# Altium schematic sheet C0 DEVB V1R0.SchDoc
size A4; SheetNumber: 1; SheetTotal: 1
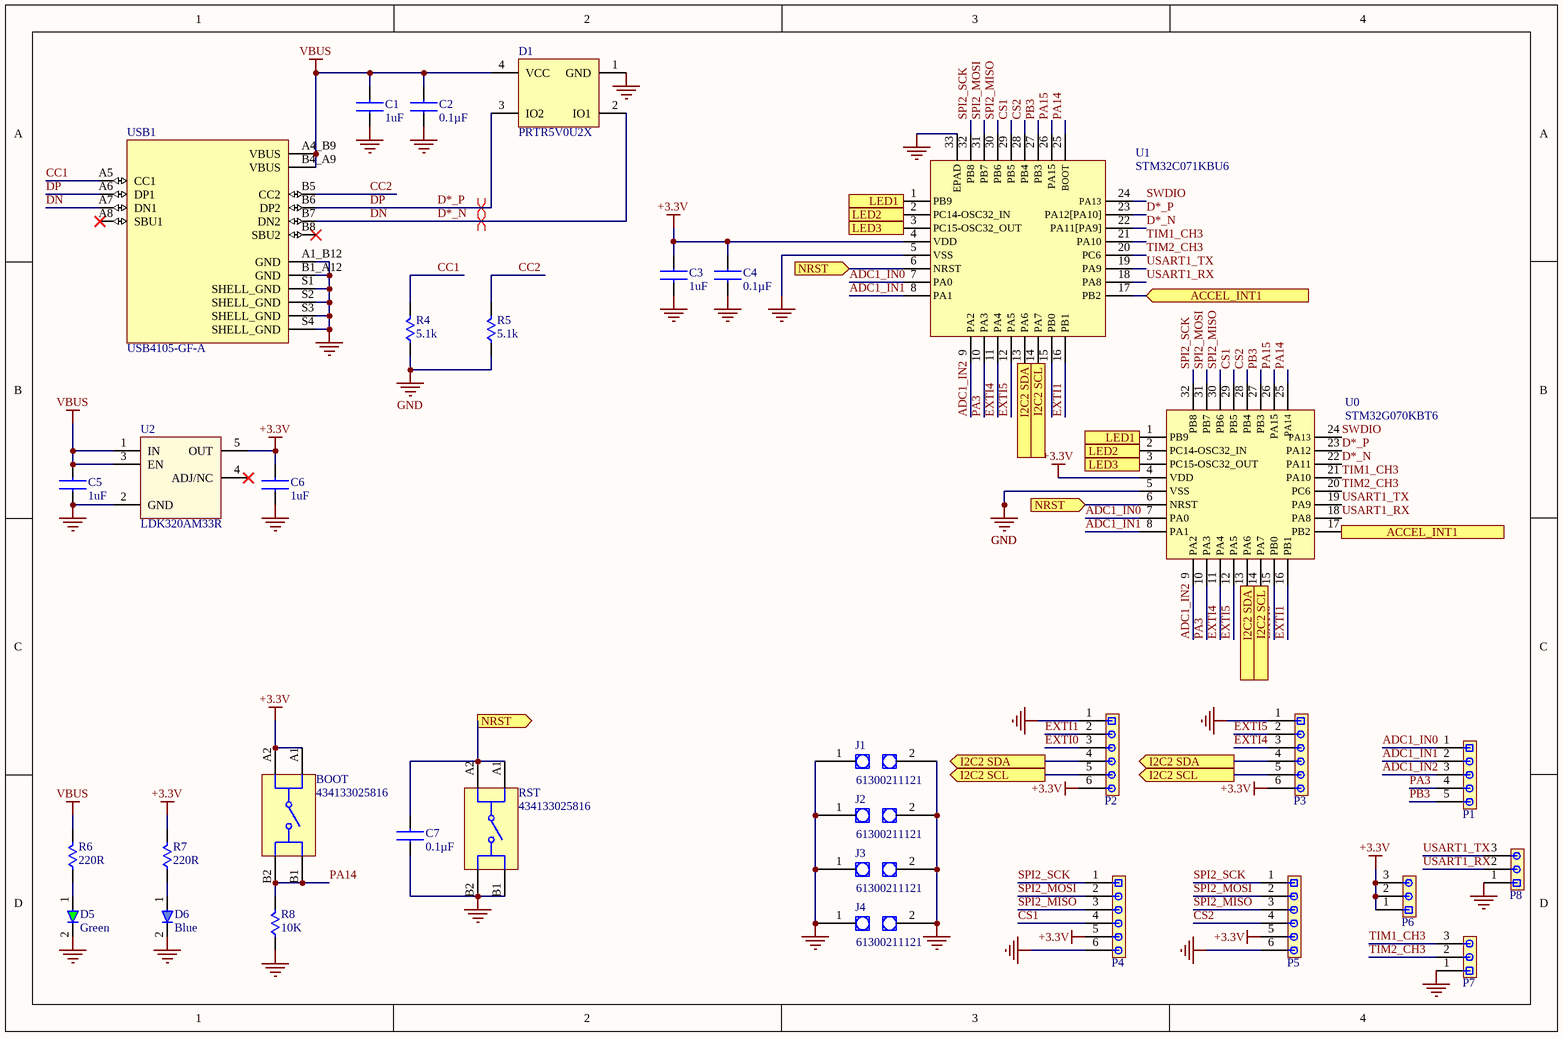
[diagram p0: C0 DEVB V1R0.SchDoc]

## Parts
BOOT  434133025816  [434133025816]
C1  1uF  [0603-CAP]
C2  0.1µF  [0603-CAP]
C3  1uF  [0603-CAP]
C4  0.1µF  [0603-CAP]
C5  1uF  [0603-CAP]
C6  1uF  [0603-CAP]
C7  0.1µF  [0603-CAP]
D1  PRTR5V0U2X  [SOT143B]
D5  Green  [0603-LED-GREEN]
D6  Blue  [0603-LED-BLUE]
J1  61300211121  [61300211121]
J2  61300211121  [61300211121]
J3  61300211121  [61300211121]
J4  61300211121  [61300211121]
P1  PPPC051LFBN-RC  [PPPC051LFBN-RC]  (value not drawn)
P2  68000-406HLF  [68016-406HLF]  (value not drawn)
P3  68000-406HLF  [68016-406HLF]  (value not drawn)
P4  68000-406HLF  [68016-406HLF]  (value not drawn)
P5  68000-406HLF  [68016-406HLF]  (value not drawn)
P6  61300311121  [61300311121]  (value not drawn)
P7  61300311121  [61300311121]  (value not drawn)
P8  61300311121  [61300311121]  (value not drawn)
R4  5.1k  [0603-RES]
R5  5.1k  [0603-RES]
R6  220R  [0603-RES]
R7  220R  [0603-RES]
R8  10K  [0603-RES]
RST  434133025816  [434133025816]
U0  STM32G070KBT6  [LQFP-32]
U1  STM32C071KBU6  [QFN32(5x5)]
U2  LDK320AM33R  [SOT-23-5]
USB1  USB4105-GF-A  [USB4105-GF-A]

## Ports
ACCEL_INT1 (in, see C0 DEVB V1R0[3B], PERIPHERAL[3B]), ACCEL_INT1 (in, see C0 DEVB V1R0[4C], PERIPHERAL[3B]), I2C2 SCL (out, see C0 DEVB V1R0[3B], C0 DEVB V1R0[3D], C0 DEVB V1R0[4C], PERIPHERAL[1A], PERIPHERAL[3A], PERIPHERAL[3B]), I2C2 SCL (out, see C0 DEVB V1R0[3B], C0 DEVB V1R0[3D], PERIPHERAL[1A], PERIPHERAL[3A], PERIPHERAL[3B]), I2C2 SCL (out, see C0 DEVB V1R0[3D], C0 DEVB V1R0[4C], PERIPHERAL[1A], PERIPHERAL[3A], PERIPHERAL[3B]), I2C2 SDA (out, see C0 DEVB V1R0[3B], C0 DEVB V1R0[3C], C0 DEVB V1R0[4C], PERIPHERAL[1A], PERIPHERAL[3A], PERIPHERAL[3B]), I2C2 SDA (out, see C0 DEVB V1R0[3B], C0 DEVB V1R0[3C], PERIPHERAL[1A], PERIPHERAL[3A], PERIPHERAL[3B]), I2C2 SDA (out, see C0 DEVB V1R0[3C], C0 DEVB V1R0[4C], PERIPHERAL[1A], PERIPHERAL[3A], PERIPHERAL[3B]), LED1 (out, see C0 DEVB V1R0[3A], PERIPHERAL[1D]), LED1 (out, see C0 DEVB V1R0[3B], PERIPHERAL[1D]), LED2 (out, see C0 DEVB V1R0[3A], PERIPHERAL[1D]), LED2 (out, see C0 DEVB V1R0[3B], PERIPHERAL[1D]), LED3 (out, see C0 DEVB V1R0[3A], PERIPHERAL[1D]), LED3 (out, see C0 DEVB V1R0[3B], PERIPHERAL[1D]), NRST (in, see C0 DEVB V1R0[2C], C0 DEVB V1R0[3B]), NRST (out, see C0 DEVB V1R0[3B])

## Nets
+3.3V: BOOT.A1 BOOT.A2 C3.1 C4.1 C6.1 P2.6 P3.6 P4.5 P5.5 P6.1 P6.2 P6.3 R7.2 U0.4(VDD) U1.4(VDD) U2.5(OUT)
GND: C1.2 C2.2 C3.2 C4.2 C5.2 C6.2 C7.2 D1.1(GND) D5.2(+) D6.2(-) J1.1 J1.2 J2.1 J2.2 J3.1 J3.2 J4.1 J4.2 P2.1 P3.1 P4.6 P5.6 P7.1 P8.1 R4.1 R5.1 R8.1 RST.B1 RST.B2 U0.5(VSS) U1.5(VSS) U1.33(EPAD) U2.2(GND) USB1.A1_B12(GND) USB1.B1_A12(GND) USB1.S1(SHELL_GND) USB1.S2(SHELL_GND) USB1.S3(SHELL_GND) USB1.S4(SHELL_GND)
VBUS: C1.1 C2.1 C5.1 D1.4(VCC) R6.2 U2.1(IN) U2.3(EN) USB1.A4_B9(VBUS) USB1.B4_A9(VBUS)
ACCEL_INT1: U0.17(PB2) U1.17(PB2) ; port ACCEL_INT1
ADC1_IN0: P1.1 U0.7(PA0) U1.7(PA0)
ADC1_IN1: P1.2 U0.8(PA1) U1.8(PA1)
ADC1_IN2: P1.3 U0.9(PA2) U1.9(PA2)
CC1: R4.2 USB1.A5(CC1)
CC2: R5.2 USB1.B5(CC2)
CS1: P4.4 U0.29(PB5) U1.29(PB5)
CS2: P5.4 U0.28(PB4) U1.28(PB4)
D*_N: D1.2(IO1) U0.22(PA11) U1.22(PA11[PA9]) USB1.A7(DN1) USB1.B7(DN2)  [also labelled DN]
D*_P: D1.3(IO2) U0.23(PA12) U1.23(PA12[PA10]) USB1.A6(DP1) USB1.B6(DP2)  [also labelled DP]
EXTI0: P2.3 U0.15(PB0)
EXTI1: P2.2 U0.16(PB1) U1.16(PB1)
EXTI4: P3.3 U0.11(PA4) U1.11(PA4)
EXTI5: P3.2 U0.12(PA5) U1.12(PA5)
I2C2 SCL: P2.5 P3.5 U0.14(PA7) U1.14(PA7) ; port I2C2 SCL
I2C2 SDA: P2.4 P3.4 U0.13(PA6) U1.13(PA6) ; port I2C2 SDA
LED1: U0.1(PB9) U1.1(PB9) ; port LED1
LED2: U0.2(PC14-OSC32_IN) U1.2(PC14-OSC32_IN) ; port LED2
LED3: U0.3(PC15-OSC32_OUT) U1.3(PC15-OSC32_OUT) ; port LED3
NRST: C7.1 RST.A1 RST.A2 U0.6(NRST) U1.6(NRST) ; port NRST
PA3: P1.4 U0.10(PA3) U1.10(PA3)
PA14: BOOT.B1 BOOT.B2 R8.2 U0.25(PA14) U1.25(BOOT)
PA15: U0.26(PA15) U1.26(PA15)
PB3: P1.5 U0.27(PB3) U1.27(PB3)
SPI2_MISO: P4.3 P5.3 U0.30(PB6) U1.30(PB6)
SPI2_MOSI: P4.2 P5.2 U0.31(PB7) U1.31(PB7)
SPI2_SCK: P4.1 P5.1 U0.32(PB8) U1.32(PB8)
SWDIO: U0.24(PA13) U1.24(PA13)
TIM1_CH3: P7.3 U0.21(PA10) U1.21(PA10)
TIM2_CH3: P7.2 U0.20(PC6) U1.20(PC6)
USART1_RX: P8.2 U0.18(PA8) U1.18(PA8)
USART1_TX: P8.3 U0.19(PA9) U1.19(PA9)
NetD5_1: D5.1(-) R6.1
NetD6_1: D6.1(+) R7.1

Not connected (* = marked no-connect by the designer): U1 15(PB0); U2 4(ADJ/NC)*; USB1 A8(SBU1)* B8(SBU2)*

## Layout directives
differential pair: D*_N, D*_P

## Library data of the parts
BOOT RST = CMP-03913-99472342-2: Tactile Switch, 0.05A, 16Vdc, 160Gf, Smd Rohs Compliant: Yes; Current Rating: 50mA; Voltage Rating: 16V; Insulation Resistance: 100MΩ; Contact Plating: Silver; Max Operating Temperature: 85°C; Min Operating Temperature: -40°C; RoHS: Compliant; Height: 2.5mm; Packaging: Tape and Reel
C1 C3 C5 C6 = CL10B105KA8NNNC: CAP CER 1UF 25V X7R 0603; Manufacturer: Samsung; Tolerance: 10%; Supplier 1: Digi-Key; Manufacturer Part Number: CL10B105KA8NNNC; RoHS: Yes; Category: Ceramic Capacitors; Pricing 1: 1=0,10000, 10=0,04500, 50=0,02460, 100=0,02010, 500=0,01436, 1000=0,01128 (USD); Mount: Surface Mount; Case/Package: 0603; Case Code (Metric): 1608; Case Code (Imperial): 0603; Contact Plating: Tin; Min Operating Temperature: -55°C; Max Operating Temperature: 125°C; Capacitance: 1uF; Packaging: Tape and Reel; Voltage Rating: 25V; Package Quantity: 1; Dielectric: X7R; Voltage: 25V; Series: CL; Construction: Flat; Length: 1.6mm; Width: 0.031inch; Height: 0.8mm; Thickness: 0.035inch; Depth: 0.8mm; Radiation Hardening: No; RoHS Compliant: Yes; ComponentLink1URL: https://datasheet.ciiva.com/16449/cl10b105ka8nnnc-16449544.pdf?src-supplier=Future+Electronics; ComponentLink1Description: https://datasheet.ciiva.com/16449/cl10b105ka8nnnc-16449544.pdf?src-supplier=Future+Electronics; ComponentLink2URL: https://datasheet.ciiva.com/15195/getdatasheetpartid-359554-15195726.pdf?src-supplier=Verical; ComponentLink2Description: https://datasheet.ciiva.com/15195/getdatasheetpartid-359554-15195726.pdf?src-supplier=Verical; Supplier Part Number 1: 1276-1184-1-ND
C2 = 06033C104JAZ2A: CAP CER 0.1UF 25V X7R 0603; Manufacturer: AVX Corporation; Tolerance: ±5%; Supplier 1: Digi-Key; Manufacturer Part Number: 06033C104JAZ2A; RoHS: RoHS Compliant; Category: Capacitors; Stock 1: 19625; Pricing 1: 1=0.13, 10=0.094, 100=0.044, 500=0.03086, 1000=0.02555 (USD); Packaging: Cut Tape (CT); Part Status: Active; Temperature Coefficient: X7R; Operating Temperature: -55°C ~ 125°C; Features: Soft Termination; Ratings: -; Applications: Boardflex Sensitive; Failure Rate: -; Mounting Type: Surface Mount, MLCC; Package / Case: 0603 (1608 Metric); Size / Dimension: 0.063" L x 0.032" W (1.60mm x 0.80mm); Height - Seated (Max): -; Thickness (Max): 0.035" (0.90mm); Lead Spacing: -; Lead Style: -; ComponentLink1URL: http://datasheets.avx.com/FlexitermMLCC.pdf; ComponentLink1Description: http://datasheets.avx.com/FlexitermMLCC.pdf; Supplier Part Number 1: 478-10279-1-ND; Voltage - Rated: 25V
C4 C7 = CL10B104KB8NNNL: CAP CER 0.1UF 50V X7R 0603; Manufacturer: Samsung; Capacitance: 100nF; Tolerance: 10%; Supplier 1: Digi-Key; Manufacturer Part Number: CL10B104KB8NNNL; Stock 1: 1583462; Pricing 1: 1 = 0,10000, 10 = 0,03000, 100 = 0,01350, 500 = 0,00966, 1000 = 0,00759, 2500 = 0,00690, 5000 = 0,00635 (USD); RoHS: Yes; Mount: Surface Mount; Case/Package: 0603; Min Operating Temperature: -55°C; Max Operating Temperature: 125°C; Packaging: Tape and Reel; Package Quantity: 15000; Voltage Rating: 50V; Dielectric: X7R; Voltage Rating (DC): 50V; Length: 1.6mm; Height: 0.8mm; Width: 0.031inch; Thickness: 0.035inch; Depth: 0.8mm; Radiation Hardening: No; ComponentLink1URL: https://datasheet.ciiva.com/25741/cl10b104kb8nnnl-25741341.pdf?src-supplier=Digi-Key; ComponentLink1Description: https://datasheet.ciiva.com/25741/cl10b104kb8nnnl-25741341.pdf?src-supplier=Digi-Key; ComponentLink2URL: https://datasheet.ciiva.com/26838/getdatasheetpartid-357523-26838415.pdf?src-supplier=Verical; ComponentLink2Description: https://datasheet.ciiva.com/26838/getdatasheetpartid-357523-26838415.pdf?src-supplier=Verical; Supplier Part Number 1: 1276-CL10B104KB8NNNLCT-ND
D1 = PRTR5V0U2X: TVS DIODE 5.5VWM SOT143B; Manufacturer 1: Nexperia; Manufacturer Part  1: PRTR5V0U2X,215; Direction: 211Direction; Breakdown Voltage: 6V; Value: 1pF; Number of Channels: 2NUMBER; Operating Supply Voltage: 700mV; Reverse Standoff Voltage: 5.5V; Supplier 1: Digikey; RoHS: Yes; Category: ESD and Circuit Protection ICs; Stock 1: 43284; Pricing 1: 1=0,4, 10=0,346, 100=0,2402, 500=0,18754, 1000=0,15243 (USD); Pins: 4NUMBER; Height: 1.1mm; RoHS Compliant: Yes; ComponentLink1URL: http://www.farnell.com/datasheets/109718.pdf?src-supplier=Farnell; ComponentLink1Description: http://www.farnell.com/datasheets/109718.pdf?src-supplier=Farnell; ComponentLink2URL: https://assets.nexperia.com/documents/data-sheet/PRTR5V0U2X.pdf?src-supplier=Digikey; ComponentLink2Description: https://assets.nexperia.com/documents/data-sheet/PRTR5V0U2X.pdf?src-supplier=Digikey; ComponentLink3URL: https://datasheet.octopart.com/PRTR5V0U2X%2C215-Nexperia-datasheet-5405949.pdf?src-supplier=Element14; ComponentLink3Description: https://datasheet.octopart.com/PRTR5V0U2X%2C215-Nexperia-datasheet-5405949.pdf?src-supplier=Element14; ComponentLink4URL: http://www.farnell.com/datasheets/109718.pdf?src-supplier=Newark; ComponentLink4Description: http://www.farnell.com/datasheets/109718.pdf?src-supplier=Newark; Supplier Part Number 1: 1727-3884-1-ND
D5 = 150060VS75000: LED GREEN CLEAR 0603 SMD; Manufacturer 1: Wurth Electronics; Luminous Intensity: 40mcd; Viewing Angle: 140°; Forward Voltage: 2V; Wavelength: 570nm; Lens Style: Clear,Rectangular; Forward Current: 30mA; Test Current: 20mA; Supplier 1: Digi-Key; Manufacturer Part Number 1: 150060VS75000; Stock 1: 114121; Pricing 1: 1=0,14000, 50=0,13300, 100=0,11550 (USD); RoHS: Yes; Mount: Surface Mount; Case/Package: 0603; Number of Pins: 2; Color: Green; Case Code (Metric): 1608; Case Code (Imperial): 0603; Min Operating Temperature: -40°C; Max Operating Temperature: 85°C; Package Quantity: 1; Packaging: Tape and Reel; Dominant Wavelength: 570nm; Length: 1.6mm; Width: 0.8mm; Height: 0.7mm; REACH SVHC: Unknown; RoHS Compliant: Yes; ComponentLink1URL: https://datasheet.ciiva.com/29562/150060vs75000-29562919.pdf?src-supplier=Digi-Key; ComponentLink1Description: https://datasheet.ciiva.com/29562/150060vs75000-29562919.pdf?src-supplier=Digi-Key; Supplier Part Number 1: 732-4980-1-ND
D6 = 150060BS75000: LED BLUE CLEAR 0603 SMD; Manufacturer: Wurth Electronics; Luminous Intensity: 145mcd; Forward Current: 30mA; Forward Voltage: 3.2V; Wavelength: 470nm; Viewing Angle: 140°; Lens Style: Clear,Rectangular; Test Current: 20mA; Supplier 1: Digi-Key; Manufacturer Part Number: 150060BS75000; Stock 1: 27240; Pricing 1: 1 = 0,16000, 50 = 0,14500, 100 = 0,12500, 500 = 0,10800 (USD); RoHS: Yes; Mount: Surface Mount; Case/Package: 0603; Color: Blue; Case Code (Metric): 1608; Case Code (Imperial): 0603; Min Operating Temperature: -40°C; Max Operating Temperature: 85°C; Package Quantity: 4000; Packaging: Cut Tape; Dominant Wavelength: 470nm; Length: 1.6mm; Height: 0.7mm; Width: 0.8mm; REACH SVHC: Unknown; ComponentLink1URL: https://datasheet.ciiva.com/29563/150060bs75000-29563034.pdf?src-supplier=Digi-Key; ComponentLink1Description: https://datasheet.ciiva.com/29563/150060bs75000-29563034.pdf?src-supplier=Digi-Key; ComponentLink2URL: https://datasheet.ciiva.com/29279/759426-da-01-en-chipled-0603-w-kl-blau-150060bs75000-29279193.pdf?src-supplier=Conrad; ComponentLink2Description: https://datasheet.ciiva.com/29279/759426-da-01-en-chipled-0603-w-kl-blau-150060bs75000-29279193.pdf?src-supplier=Conrad; ComponentLink3URL: https://datasheet.ciiva.com/48430/150060bs75000-eng-tds-48430039.pdf?src-supplier=Distrelec; ComponentLink3Description: https://datasheet.ciiva.com/48430/150060bs75000-eng-tds-48430039.pdf?src-supplier=Distrelec; ComponentLink4URL: https://datasheet.ciiva.com/22656/1911343-22656939.pdf?src-supplier=Element14; ComponentLink4Description: https://datasheet.ciiva.com/22656/1911343-22656939.pdf?src-supplier=Element14; ComponentLink5URL: https://datasheet.ciiva.com/29563/150060bs75000-29563035.pdf?src-supplier=Digi-Key; ComponentLink5Description: https://datasheet.ciiva.com/29563/150060bs75000-29563035.pdf?src-supplier=Digi-Key; ComponentLink6URL: https://datasheet.ciiva.com/29563/150060bs75000-29563036.pdf?src-supplier=Digi-Key; ComponentLink6Description: https://datasheet.ciiva.com/29563/150060bs75000-29563036.pdf?src-supplier=Digi-Key; Supplier Part Number 1: 732-4966-1-ND
J1-J4 = 61300211121: CONN HEADER VERT 2POS 2.54MM; Manufacturer: Wurth Electronics; Current Rating: 3A; Voltage Rating: 250V; Number of Positions: 2; Gender: Male; Connector Type: Male Pin; Pitch: 0.1inch; Supplier 1: Digi-Key; Manufacturer Part Number: 61300211121; Stock 1: 102087; Pricing 1: 1 = 0,13000, 10 = 0,10600, 25 = 0,08800, 50 = 0,07400, 100 = 0,06700, 1000 = 0,06100 (USD); RoHS: Yes; Mount: Through Hole; Contact Plating: Gold; Housing Material: PBT; Contact Material: Copper Alloy,Copper; Color: Black; Min Operating Temperature: -40°C; Max Operating Temperature: 125°C; Number of Rows: 1; Contact Gender: Male; Packaging: Bulk; Termination: Through Hole; Number of Contacts: 2; Contact Mating Length: 0.236inch; REACH SVHC: Unknown; Lead Free: Lead Free; ComponentLink1URL: https://datasheet.ciiva.com/13619/6130xx11121-48870-13619345.pdf?src-supplier=Mouser; ComponentLink1Description: https://datasheet.ciiva.com/13619/6130xx11121-48870-13619345.pdf?src-supplier=Mouser; Supplier Part Number 1: 732-5315-ND
P1 = PPPC051LFBN-RC: CONN HDR 5POS 0.1 GOLD PCB; Manufacturer 1: Sullins; Number of Positions: 5; Connector Type: Header; Pitch: 0.1inch; Supplier 1: Digi-Key; Manufacturer Part Number 1: PPPC051LFBN-RC; RoHS: Yes; Category: Connectors; Stock 1: 13836; Pricing 1: 1=0,49000, 10=0,45900, 100=0,35190, 500=0,30600, 1000=0,25245, 5000=0,22185, 10000=0,22100 (USD); Mount: Through Hole; Color: Black; Contact Plating: Gold; Contact Material: Bronze; Housing Material: Plastic; Package Quantity: 1000; Number of Rows: 1; Packaging: Bulk; Termination: Solder; Contact Type: Female Socket; Length: 13.2mm; Width: 2.5mm; Height: 8.5mm; Lead Free: Lead Free; RoHS Compliant: Yes; ComponentLink1URL: https://media.digikey.com/pdf/Data%20Sheets/Sullins%20PDFs/Female_Headers.100_DS.pdf?src-supplier=Digi-Key; ComponentLink1Description: https://media.digikey.com/pdf/Data%20Sheets/Sullins%20PDFs/Female_Headers.100_DS.pdf?src-supplier=Digi-Key; ComponentLink2URL: http://www.sullinscorp.com/catalogs/78_Page80-81_HEADER_.100_2.54mm_FEMALE.pdf?src-supplier=Future+Electronics; ComponentLink2Description: http://www.sullinscorp.com/catalogs/78_Page80-81_HEADER_.100_2.54mm_FEMALE.pdf?src-supplier=Future+Electronics; Supplier Part Number 1: S7038-ND
P2-P5 = 68016-406HLF: CONN HEADER R/A 6POS 2.54MM; Manufacturer 1: Amphenol FCI; Connector Type: Male Pin; Gender: Male; Current Rating: 3A; Voltage Rating: 1.5kV; Number of Positions: 6; Insulation Resistance: 5GR; Contact Post Length: 3.05mm; Supplier 1: Digi-Key; Manufacturer Part Number 1: 68016-406HLF; RoHS: Yes; Category: Headers and Wire Housings; Stock 1: 2017; Pricing 1: 1=0,36000, 10=0,34400, 100=0,24080, 500=0,20644, 1000=0,17203, 5000=0,14745, 10000=0,13762 (USD); Mount: Through Hole; Housing Material: Thermoplastic; Contact Plating: Tin; Contact Material: Bronze; Color: Black; Min Operating Temperature: -65°C; Max Operating Temperature: 125°C; Packaging: Bulk; Number of Rows: 1; Contact Gender: Male; Package Quantity: 100; Termination: Solder; Number of Contacts: 6; Pitch: 2.54mm; Contact Mating Length: 0.23inch; Radiation Hardening: No; Flammability Rating: UL94 V-0; ComponentLink1URL: https://datasheet.ciiva.com/728/68015-728878.pdf?src-supplier=Digi-Key; ComponentLink1Description: https://datasheet.ciiva.com/728/68015-728878.pdf?src-supplier=Digi-Key; ComponentLink2URL: https://datasheet.ciiva.com/5163/68015-5163386.pdf?src-supplier=Mouser; ComponentLink2Description: https://datasheet.ciiva.com/5163/68015-5163386.pdf?src-supplier=Mouser; Supplier Part Number 1: 609-3327-ND
P6-P8 = 61300311121: CONN HEADER VERT 3POS 2.54MM; Manufacturer: Wurth Electronics; Number of Positions: 3; Gender: Male; Connector Type: Male Pin; Pitch: 0.1inch; Supplier 1: Digi-Key; Manufacturer Part Number: 61300311121; Stock 1: 87341; Pricing 1: 1 = 0,13000, 10 = 0,10600, 25 = 0,08800, 50 = 0,07400, 100 = 0,06700, 1000 = 0,06100 (USD); RoHS: Yes; Mount: Through Hole; Contact Plating: Gold; Contact Material: Copper; Color: Black; Number of Rows: 1; Packaging: Bulk; Termination: Solder; Number of Contacts: 3; Contact Mating Length: 0.236inch; REACH SVHC: Unknown; Lead Free: Lead Free; ComponentLink1URL: http://www.farnell.com/cad/1737268.pdf?src-supplier=Element14; ComponentLink1Description: http://www.farnell.com/cad/1737268.pdf?src-supplier=Element14; ComponentLink2URL: https://katalog.we-online.de/em/datasheet/6130xx11121.pdf?src-supplier=Digi-Key; ComponentLink2Description: https://katalog.we-online.de/em/datasheet/6130xx11121.pdf?src-supplier=Digi-Key; Supplier Part Number 1: 732-5316-ND
R4 R5 = CPF-A-0603B220RE: RES SMD TBD OHM 0.1% 1/16W 0603; Manufacturer: TE Connectivity; Temperature Coefficient: 25ppm/°C; Max Power Dissipation: 63mW; Supplier 1: Digi-Key; Stock 1: 4490; Pricing 1: 1=0.54, 10=0.384, 100=0.1999, 1000=0.10762, 2500=0.10616 (USD); Case/Package: 0603; Case Code (Imperial): 0603; Case Code (Metric): 1608; Min Operating Temperature: -55°C; Max Operating Temperature: 155°C; Resistance: TBD; Composition: Thin Film; Packaging: Tape and Reel; Tolerance: 0.1%; Number of Terminations: 2; Features: Moisture Resistant,Automotive AEC-Q200,Anti-Sulfur; Supplier Part Number 1: A123979CT-ND
R6 R7 = CPF-A-0603B220RE: RES SMD 220 OHM 0.1% 1/16W 0603; Manufacturer: TE Connectivity; Temperature Coefficient: 25ppm/°C; Max Power Dissipation: 63mW; Supplier 1: Digi-Key; Manufacturer Part Number: CPF-A-0603B220RE; Stock 1: 4490; Pricing 1: 1=0.54, 10=0.384, 100=0.1999, 1000=0.10762, 2500=0.10616 (USD); Case/Package: 0603; Case Code (Imperial): 0603; Case Code (Metric): 1608; Min Operating Temperature: -55°C; Max Operating Temperature: 155°C; Resistance: 220R; Composition: Thin Film; Packaging: Tape and Reel; Tolerance: 0.1%; Number of Terminations: 2; Features: Moisture Resistant,Automotive AEC-Q200,Anti-Sulfur; Supplier Part Number 1: A123979CT-ND
R8 = RC0603FR-0710KL: RES SMD 10K OHM 1% 1/10W 0603; Manufacturer 1: Yageo; Resistance: 10kR; Temperature Coefficient: 100ppm/°C; Voltage Rating (DC): 50V; Power Rating: 100mW; Voltage Rating: 75V; Supplier 1: Digi-Key; Manufacturer Part Number 1: RC0603FR-0710KL; Stock 1: 45404531; Pricing 1: 1=0,10000, 10=0,02300, 100=0,00940, 1000=0,00421, 2500=0,00366 (USD); RoHS: Yes; Case/Package: 0603; Number of Pins: 2; Weight: 7.1E-05oz; Case Code (Imperial): 0603; Case Code (Metric): 1608; Min Operating Temperature: -55°C; Max Operating Temperature: 155°C; Tolerance: 1%; Composition: Thick Film; Packaging: Tape and Reel; Military Standard: Not; Termination: SMD/SMT; Length: 1.6mm; Height: 0.45mm; Width: 0.8mm; Depth: 0.8mm; Lead Pitch: 0.3mm; REACH SVHC: No SVHC; Lead Free: Lead Free; ComponentLink1URL: https://datasheet.ciiva.com/7660/38590-7660789.pdf?src-supplier=Element14; ComponentLink1Description: https://datasheet.ciiva.com/7660/38590-7660789.pdf?src-supplier=Element14; ComponentLink2URL: https://datasheet.ciiva.com/22747/443971-22747519.pdf?src-supplier=Element14; ComponentLink2Description: https://datasheet.ciiva.com/22747/443971-22747519.pdf?src-supplier=Element14; ComponentLink3URL: https://datasheet.ciiva.com/15189/getdatasheetpartid-409289-15189591.pdf?src-supplier=Verical; ComponentLink3Description: https://datasheet.ciiva.com/15189/getdatasheetpartid-409289-15189591.pdf?src-supplier=Verical; ComponentLink4URL: https://datasheet.ciiva.com/46440/1868787-46440891.pdf?src-supplier=Element14; ComponentLink4Description: https://datasheet.ciiva.com/46440/1868787-46440891.pdf?src-supplier=Element14; ComponentLink5URL: https://datasheet.ciiva.com/7983/443971-7983596.pdf?src-supplier=Element14; ComponentLink5Description: https://datasheet.ciiva.com/7983/443971-7983596.pdf?src-supplier=Element14; ComponentLink6URL: https://datasheet.ciiva.com/7746/1738695-7746239.pdf?src-supplier=Element14; ComponentLink6Description: https://datasheet.ciiva.com/7746/1738695-7746239.pdf?src-supplier=Element14; Supplier Part Number 1: 311-10.0KHRCT-ND
U0 = STM32G070KBT6: IC MCU 32BIT 128KB FLASH 32LQFP; Manufacturer 1: STMicroelectronics; Interface: I2C,SPI,I2S,USART,LIN; Core Architecture: ARM; Data Bus Width: 32b; Max Frequency: 64MHz; RAM Size: 36KB; Number of I/Os: 29; Number of ADC Channels: 13; Max Supply Voltage: 3.6V; Min Supply Voltage: 2V; Supplier 1: Digi-Key; Manufacturer Part Number 1: STM32G070KBT6; RoHS: No; Category: Microcontrollers; Stock 1: 987; Pricing 1: 1=1,75000, 10=1,57400, 25=1,48520, 100=1,26520, 250=1,18800, 500=1,03950, 1000=0,86130, 2500=0,80190, 5000=0,77220 (USD); Case/Package: LQFP; Min Operating Temperature: -40°C; Max Operating Temperature: 85°C; Memory Type: FLASH; Memory Size: 128KB; Package Quantity: 250; ComponentLink1URL: https://datasheet.ciiva.com/71223/stm32g070cb-1517433-71223599.pdf?src-supplier=Mouser; ComponentLink1Description: https://datasheet.ciiva.com/71223/stm32g070cb-1517433-71223599.pdf?src-supplier=Mouser; Supplier Part Number 1: 497-STM32G070KBT6-ND
U1 = STM32C071KBU6: IC MCU 32BIT 128KB FLSH 32UFQFPN; Manufacturer: STMicroelectronics; Interface: I2C,SPI,USB,HDMI,IrDA,UART,USART; Peripherals: Brown-out Detect/Reset,POR,PWM,WDT,DMA; Memory Type: FLASH; Core Architecture: ARM; Frequency: 48MHz; Number of I/Os: 30; Oscillator Type: Internal; Supplier 1: Digi-Key; Manufacturer Part Number: STM32C071KBU6; RoHS: No; Category: Microcontrollers; Pricing 1: 1=3,90000, 10=3,49900, 25=3,30800, 80=2,86700, 230=2,71996, 440=2,45041 (USD); Case/Package: UFQFPN; Min Operating Temperature: -40°C; Max Operating Temperature: 85°C; Packaging: Tray; Memory Size: 128KB; ComponentLink1URL: https://www.st.com/resource/en/datasheet/stm32g071cb.pdf?src-supplier=Digi-Key; ComponentLink1Description: https://www.st.com/resource/en/datasheet/stm32g071cb.pdf?src-supplier=Digi-Key; Supplier Part Number 1: 497-18357-ND
U2 = LDK320AM33R: IC REG LINEAR 3.3V 200MA SOT23-5; Manufacturer: STMicroelectronics; Output Type: Fixed; Output Configuration: Positive; Number of Regulators: 1; Max Input Voltage: 18V; Dropout Voltage: 350mV; Quiescent Current: 90uA; Max Supply Current: 100uA; Power Supply Rejection Ratio (PSRR): 88dB; Supplier 1: Digi-Key; Manufacturer Part Number: LDK320AM33R; RoHS: Yes; Category: Voltage Regulators - Linear; Stock 1: 91850; Pricing 1: 1=0,91000, 10=0,81400, 25=0,77280, 100=0,63490, 250=0,59344, 500=0,52444, 1000=0,41404 (USD); Mount: Surface Mount; Case/Package: SOT-23-5; Min Operating Temperature: -40°C; Max Operating Temperature: 125°C; Packaging: Cut Tape; Min Output Voltage: 3.3V; Output Current: 200mA; RoHS Compliant: Yes; ComponentLink1URL: http://www.farnell.com/datasheets/2342740.pdf?src-supplier=Farnell; ComponentLink1Description: http://www.farnell.com/datasheets/2342740.pdf?src-supplier=Farnell; ComponentLink2URL: https://www.st.com/resource/en/datasheet/ldk320.pdf?src-supplier=Digi-Key; ComponentLink2Description: https://www.st.com/resource/en/datasheet/ldk320.pdf?src-supplier=Digi-Key; ComponentLink3URL: http://www.farnell.com/datasheets/2342740.pdf?src-supplier=Newark; ComponentLink3Description: http://www.farnell.com/datasheets/2342740.pdf?src-supplier=Newark; Supplier Part Number 1: 497-16702-1-ND
USB1 = USB4105-GF-A: CONN RCP USB2.0 TYP C 24P SMD RA; Manufacturer: Global Connector Technology; Supplier 1: Digi-Key; Manufacturer Part Number: USB4105-GF-A; RoHS: No; Category: USB Connectors; Supplier Part Number 1: 2073-USB4105-GF-ACT-ND